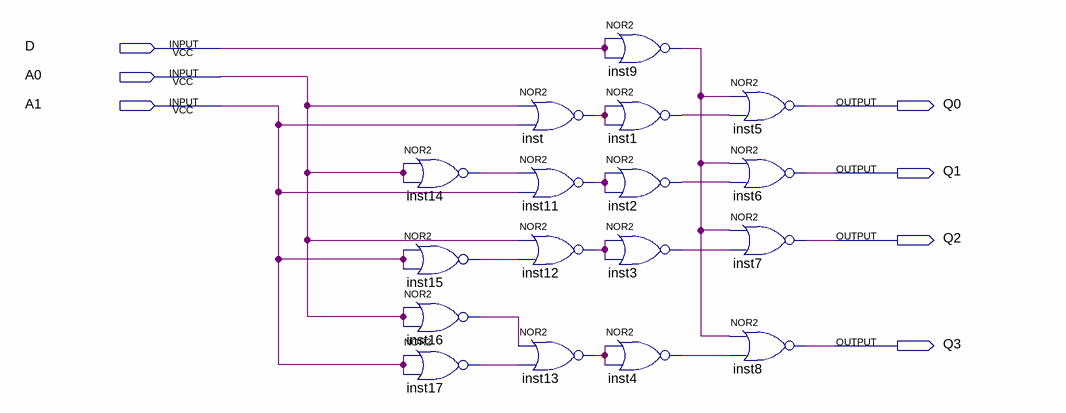
[diagram p0: schematic sheet]
// Quartus schematic DMX_2_address_input_2nor.bdf as structural Verilog: 17 symbols, 7 pins
module DMX_2_address_input_2nor (
  input  D,
  input  A0,
  input  A1,
  output Q0,
  output Q1,
  output Q2,
  output Q3
);

  wire inst1_out, inst2_out, inst3_out, inst4_out, inst9_out, inst11_out, inst12_out, inst13_out, inst14_out,
       inst15_out, inst16_out, inst17_out, inst_out;

  nor inst14 (inst14_out, A0, A0);
  nor inst15 (inst15_out, A1, A1);
  nor inst16 (inst16_out, A0, A0);
  nor inst17 (inst17_out, A1, A1);
  nor inst (inst_out, A0, A1);
  nor inst11 (inst11_out, inst14_out, A1);
  nor inst12 (inst12_out, A0, inst15_out);
  nor inst13 (inst13_out, inst16_out, inst17_out);
  nor inst9 (inst9_out, D, D);
  nor inst1 (inst1_out, inst_out, inst_out);
  nor inst2 (inst2_out, inst11_out, inst11_out);
  nor inst3 (inst3_out, inst12_out, inst12_out);
  nor inst4 (inst4_out, inst13_out, inst13_out);
  nor inst5 (Q0, inst9_out, inst1_out);
  nor inst6 (Q1, inst9_out, inst2_out);
  nor inst7 (Q2, inst9_out, inst3_out);
  nor inst8 (Q3, inst9_out, inst4_out);
endmodule
